# EAGLE design JPC_XE1AP_rev_A (EAGLE 9.6.2)
PC Engine Joypad Breakout Version 1.0
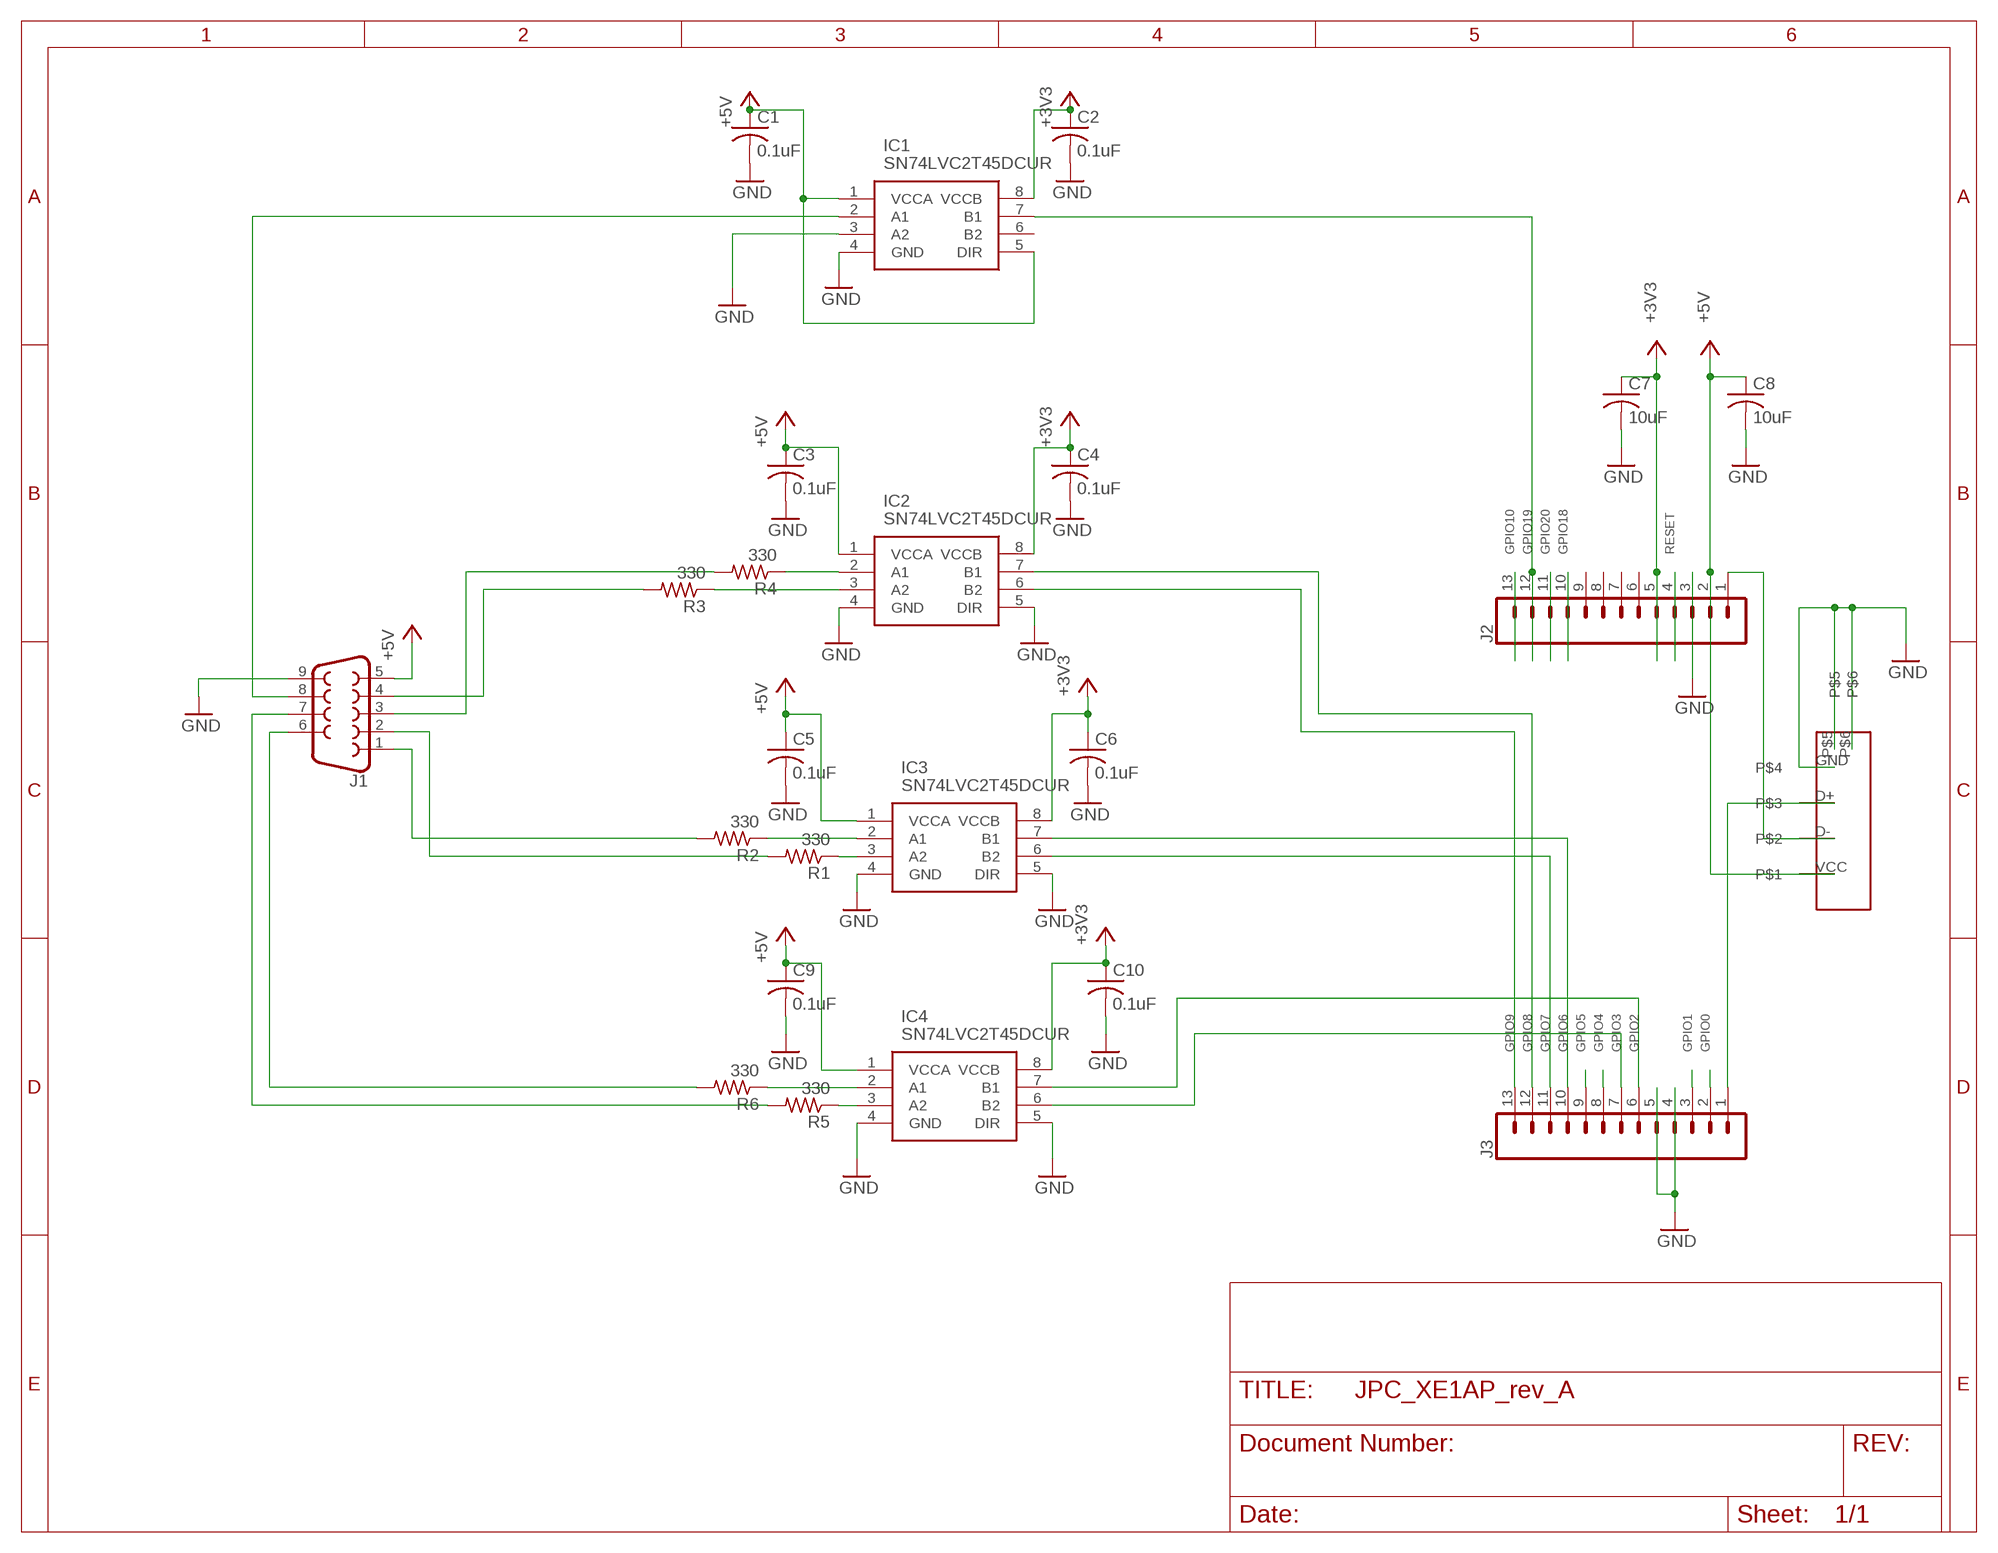
[diagram p0: schematic, sheet 1]

## Parts
C1  0.1uF  C-USC0402  [C0402]
C2  0.1uF  C-USC0402  [C0402]
C3  0.1uF  C-USC0402  [C0402]
C4  0.1uF  C-USC0402  [C0402]
C5  0.1uF  C-USC0402  [C0402]
C6  0.1uF  C-USC0402  [C0402]
C7  10uF  C-USC0805  [C0805]
C8  10uF  C-USC0805  [C0805]
C9  0.1uF  C-USC0402  [C0402]
C10  0.1uF  C-USC0402  [C0402]
IC1  SN74LVC2T45DCUR  [SOP50P310X90-8N]
IC2  SN74LVC2T45DCUR  [SOP50P310X90-8N]
IC3  SN74LVC2T45DCUR  [SOP50P310X90-8N]
IC4  SN74LVC2T45DCUR  [SOP50P310X90-8N]
J1  DB9FEMALE  [DB9]
J2  CONN_131X13-LONGPADS-B  [1X13-LONGPADS-B]
J3  CONN_13LONGPADS  [1X13-LONGPADS]
R1  330  R-US_R0402  [R0402]
R2  330  R-US_R0402  [R0402]
R3  330  R-US_R0402  [R0402]
R4  330  R-US_R0402  [R0402]
R5  330  R-US_R0402  [R0402]
R6  330  R-US_R0402  [R0402]
U$1  912-121A2026S10100  [912-121A2026S10100]

## Nets
+3V3 [power]: C2.1 C4.1 C6.1 C7.1 C10.1 IC1.8(VCCB) IC2.8(VCCB) IC3.8(VCCB) IC4.8(VCCB) J2.5
+5V [power]: C1.1 C3.1 C5.1 C8.1 C9.1 IC1.1(VCCA) IC1.5(DIR) IC2.1(VCCA) IC3.1(VCCA) IC4.1(VCCA) J1.5 J2.2 U$1.VCC
CLR [signal]: IC1.2(A1) J1.8
GND: C1.2 C2.2 C3.2 C4.2 C5.2 C6.2 C7.2 C8.2 C9.2 C10.2 IC1.3(A2) IC1.4(GND) IC2.4(GND) IC2.5(DIR) IC3.4(GND) IC3.5(DIR) IC4.4(GND) IC4.5(DIR) J1.9 J2.3 J3.4 J3.5 U$1.GND U$1.P$5 U$1.P$6
GPIO0: J3.2
GPIO1: J3.3
GPIO2: IC4.7(B1) J3.6
GPIO3: IC4.6(B2) J3.7
GPIO4: J3.8
GPIO5: J3.9
GPIO6: IC3.7(B1) J3.10
GPIO7: IC3.6(B2) J3.11
GPIO8: IC2.7(B1) J3.12
GPIO9: IC2.6(B2) J3.13
GPIO10: J2.13
GPIO18: J2.10
GPIO19: IC1.7(B1) J2.12
GPIO20: J2.11
N$1: J3.1 U$1.D+
N$2: J1.1 R2.2
N$3: IC4.2(A1) R6.1
N$4: IC4.3(A2) R5.1
N$5: J1.2 R1.2
N$6: J1.3 R4.2
N$7: J1.4 R3.2
N$8: IC3.3(A2) R1.1
N$9: IC3.2(A1) R2.1
N$10: IC2.3(A2) R3.1
N$11: IC2.2(A1) R4.1
N$12: J2.1 U$1.D-
N$13: J1.6 R6.2
N$14: J1.7 R5.2
RESET: J2.4
Unconnected: IC1.6(B2) J2.6 J2.7 J2.8 J2.9

## Library data of the parts
C1-C6 C9 C10 = PC-Engine0402:C-US: CAPACITOR, American symbol
C7 C8 = resistor:C-US: CAPACITOR, American symbol
IC1-IC4 = PC-Engine:SN74LVC2T45DCUR: Texas Instruments SN74LVC2T45DCUR, Voltage Level Translator, Bus Transceiver, 3-State, 1.65 5.5 V, 8-Pin UM Source: Datasheet <http://www.ti.com/lit/gpn/sn74lvc2t45>; ARROW_PART_NUMBER: SN74LVC2T45DCUR; ARROW_PRICE-STOCK: https://www.arrow.com/en/products/sn74lvc2t45dcur/texas-instruments?region=nac; DESCRIPTION: Texas Instruments SN74LVC2T45DCUR, Voltage Level Translator, Bus Transceiver, 3-State, 1.65 5.5 V, 8-Pin UM; HEIGHT: 0.9mm; MANUFACTURER_NAME: Texas Instruments; MANUFACTURER_PART_NUMBER: SN74LVC2T45DCUR; MOUSER_PART_NUMBER: 595-SN74LVC2T45DCUR; MOUSER_PRICE-STOCK: https://www.mouser.co.uk/ProductDetail/Texas-Instruments/SN74LVC2T45DCUR?qs=0smPjiIwnfIdG9vxyJHBdA%3D%3D
J1 = SparkFun-Connectors:DB9: DB9 Connector Standard DB9 (D-Sub 9) serial connector. Can be used for CAN bus as well as RS485 and RS232. Footprint production proven. Here is the female version connector we sell at SparkFun: 9 Pin Female Serial Connector - PCB Mount <https://www.sparkfun.com/products/429> (PRT-00429) This connector has been used on the following SparkFun products: SparkFun RS232 Shifter - SMD <https://www.sparkfun.com/products/449> (PRT-00449) SparkFun RS232 Shifter SMD (No DB9) <https://www.sparkfun.com/products/8780> (PRT-08780); PROD_ID: CONN-08194
J2 J3 = KB2040:CONN_13: Multi connection point. Often used as Generic Header-pin footprint for 0.1 inch spaced/style header connections On any of the 0.1 inch spaced packages, you can populate with these: Break Away Headers - Straight <https://www.sparkfun.com/products/116> (PRT-00116) Break Away Male Headers - Right Angle <https://www.sparkfun.com/products/553> (PRT-00553) Female Headers <https://www.sparkfun.com/products/115> (PRT-00115) Break Away Headers - Machine Pin <https://www.sparkfun.com/products/117> (PRT-00117) Break Away Female Headers - Swiss Machine Pin <https://www.sparkfun.com/products/743> (PRT-00743) For SCREWTERMINALS and SPRING TERMINALS visit here: Screw Terimnals on SparkFun.com <https://www.sparkfun.com/search/results?term=Screw+Terminals> (5mm/3.5mm/2.54mm spacing) This device is also useful as a general connection point to wire up your design to another part of your project. Our various solder wires solder well into these plated through hole pads. Hook-Up Wire - Assortment (Stranded, 22 AWG) <https://www.sparkfun.com/products/11375> (PRT-11375) Hook-Up Wire - Assortment (Solid Core, 22 AWG) <https://www.sparkfun.com/products/11367> (PRT-11367) View the entire wire category on our website here <https://www.sparkfun.com/categories/141> Special notes: Molex polarized connector foot print use with SKU : PRT-08231 with associated crimp pins and housings. 1MM SMD Version SKU: PRT-10208 NOTES ON THE VARIANTS LOCK and LOCK_LONGPADS... This footprint was designed to help hold the alignment of a through-hole component (i.e. 6-pin header) while soldering it into place. You may notice that each hole has been shifted either up or down by 0.005 of an inch from it's more standard position (which is a perfectly straight line). This slight alteration caused the pins (the squares in the middle) to touch the edges of the holes. Because they are alternating, it causes a "brace" to hold the component in place. 0.005 has proven to be the perfect amount of "off-center" position when using our standard breakaway headers. Although looks a little odd when you look at the bare footprint, once you have a header in there, the alteration is very hard to notice. Also,if you push a header all the way into place, it is covered up entirely on the bottom side.
R1-R6 = PC-Engine0402:R-US_: RESISTOR, American symbol
U$1 = PC-Engine:912-121A2026S10100

## Net classes
0 default: width 0.152 mm, drill 0.356 mm, clearance 0.152 mm
1 power: width 0.305 mm, drill 0.356 mm, clearance 0.152 mm
2 signal: width 0.152 mm, drill 0.356 mm, clearance 0.152 mm

## Board
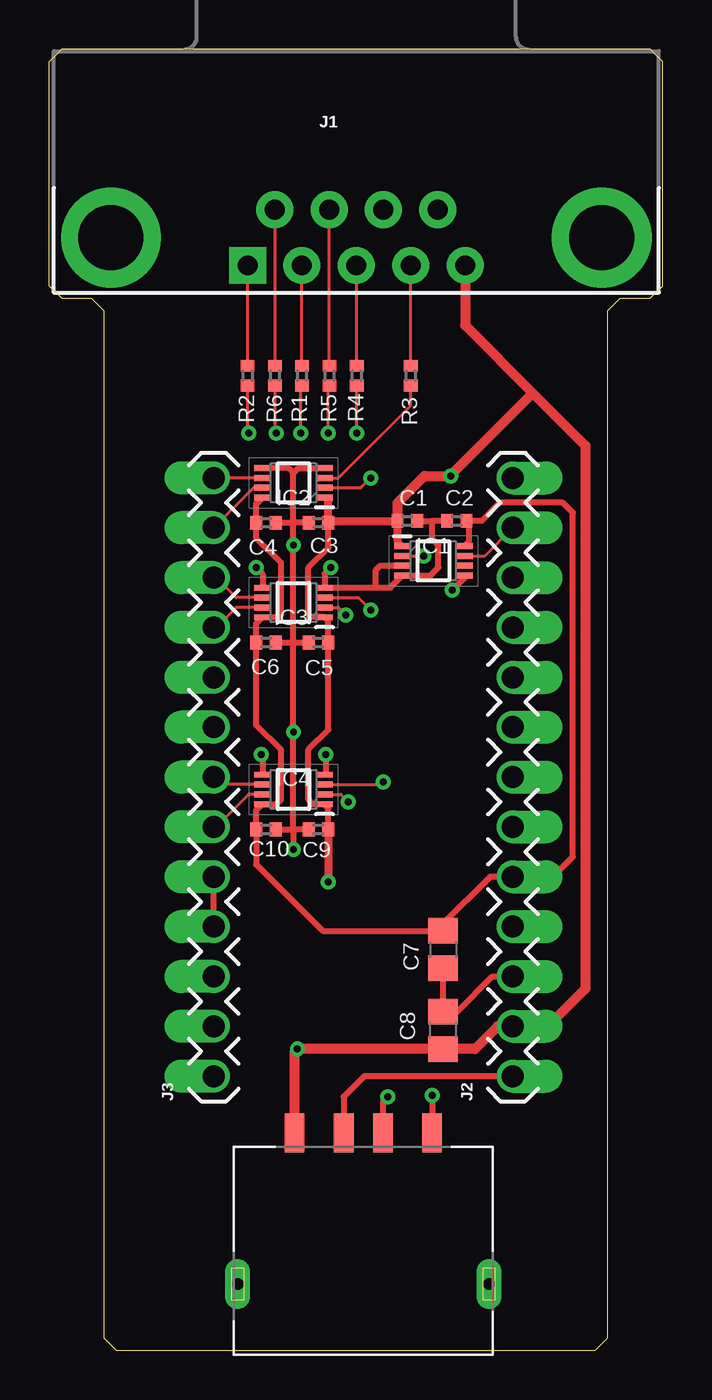
[diagram p1: board, top side]
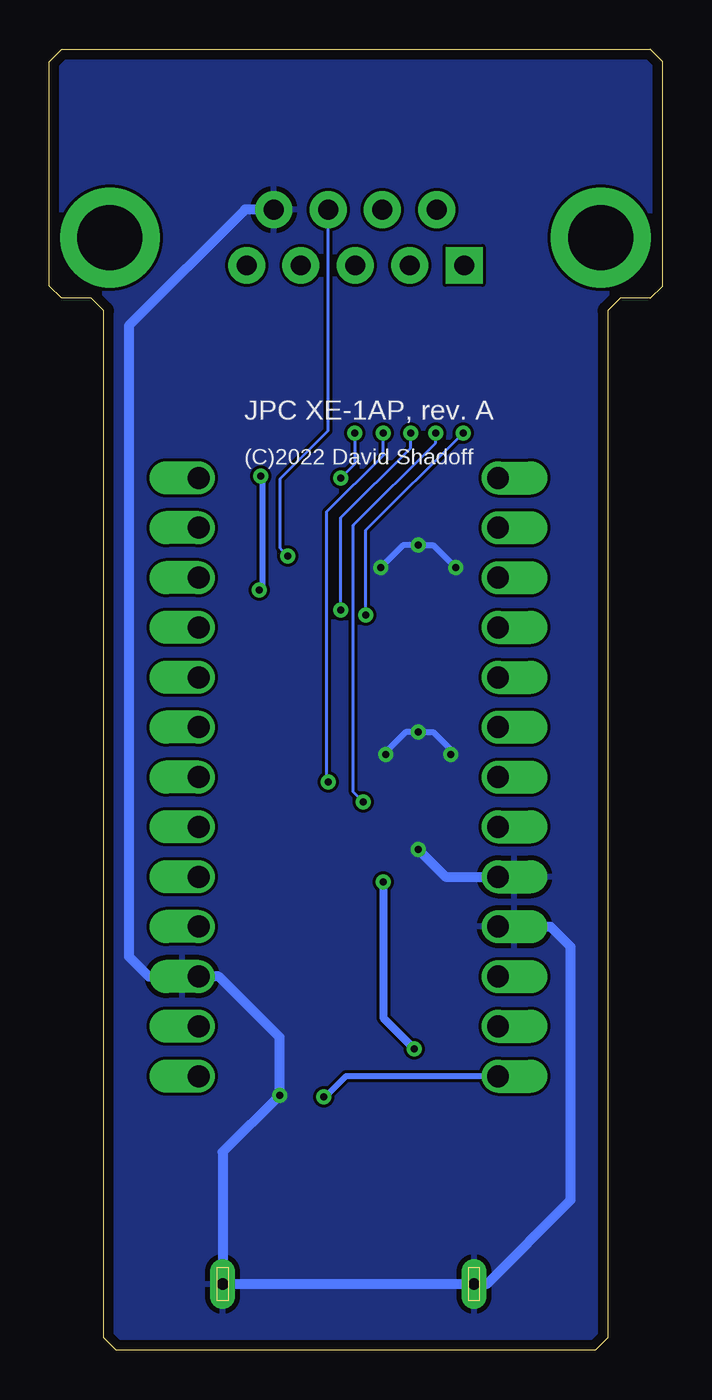
[diagram p2: board, bottom side, seen from below]

Size 31.24 x 66.29 mm. Coordinates in mm from the lower left corner, seen from the top.
Outline: 2.79,52.96 2.79,0.64 3.43,0 27.81,0 28.45,0.64 28.45,52.96 29.08,53.59 30.61,53.59 31.24,54.23 31.24,65.66 30.61,66.29 0.64,66.29 0,65.66 0,54.23 0.64,53.59 2.16,53.59 2.79,52.96
Copper layers (1*16): Top 0.035mm / dielectric 1.5mm / Bottom 0.035mm
Design rules "default *": minimum track width 6mil, minimum drill 0.35mm, track to track 6mil, track to pad 6mil, pad to pad 6mil, via to via 6mil, smd to smd 6mil, copper to edge 20mil, drill to drill 6mil, minimum pad ring 10mil, minimum via ring 8mil, stop-mask expansion 3mil, vias tented up to drill 18mil, thermal gap 10mil

### Footprints (pad centres in the part's own frame; a part is rotated, then mirrored left to right if it is on the bottom)
C0402 = smd 0.6 x 0.7: 1 -0.5,0; 2 0.5,0
C0805 = smd 1.3 x 1.5: 1 -0.95,0; 2 0.95,0
SOP50P310X90-8N = smd 0.85 x 0.3: 1 -1.575,0.75; 2 -1.575,0.25; 3 -1.575,-0.25; 4 -1.575,-0.75; 5 1.575,-0.75; 6 1.575,-0.25; 7 1.575,0.25; 8 1.575,0.75
DB9 = drill 1.016 pad 1.88 square: 1 -5.54,-1.42 | drill 1.016 pad 1.88: 2 -2.77,-1.42; 3 0,-1.42; 4 2.77,-1.42; 5 5.54,-1.42; 6 -4.15,1.42; 7 -1.38,1.42; 8 1.38,1.42; 9 4.15,1.42 | drill 3.302 pad 5.08: G1 -12.5,0; G2 12.5,0
1X13-LONGPADS-B = drill 1.118 offset: 1 0,0; 2 2.54,0; 3 5.08,0; 4 7.62,0; 5 10.16,0; 6 12.7,0; 7 15.24,0; 8 17.78,0; 9 20.32,0; 10 22.86,0; 11 25.4,0; 12 27.94,0; 13 30.48,0
1X13-LONGPADS = drill 1.118 offset: 1 0,0; 2 2.54,0; 3 5.08,0; 4 7.62,0; 5 10.16,0; 6 12.7,0; 7 15.24,0; 8 17.78,0; 9 20.32,0; 10 22.86,0; 11 25.4,0; 12 27.94,0; 13 30.48,0
R0402 = smd 0.6 x 0.7: 1 -0.5,0; 2 0.5,0
912-121A2026S10100 = smd 1 x 2: D+ 1,6; D- -1,6; GND 3.5,6; VCC -3.5,6 | drill 0.6 pad 1.27 long: P$5 -6.4,-1.7; P$6 6.4,-1.7

### Placement (x,y rotation side)
C1  18.25,42.26 0 top
C2  20.76,42.26 180 top
C3  13.72,42.16 180 top
C4  11.05,42.16 0 top
C5  13.72,36.07 180 top
C6  11.05,36.07 0 top
C7  20.07,20.42 270 top
C8  20.07,16.31 90 top
C9  13.72,26.54 180 top
C10  11.05,26.54 0 top
IC1  19.57,40.22 0 top
IC2  12.45,44.2 180 top
IC3  12.45,38.1 180 top
IC4  12.45,28.57 180 top
J1  15.65,56.69 0 top
J2  23.62,13.97 90 top
J3  8.38,13.97 90 top
R1  12.88,49.66 90 top
R2  10.11,49.66 90 top
R3  18.41,49.66 90 top
R4  15.67,49.66 90 top
R5  14.27,49.66 90 top
R6  11.51,49.66 90 top
U$1  16,5.08 0 top

### Tracks (layer width: path | path; a pad name or v marks a point on that pad's centre or on a via)
+3V3
  Top 0.305: IC1.8 21.37,41.2 21.37,42.15 C2.1 22.02,42.26 22.95,43.18 26.16,43.18 26.67,42.67 26.67,25.15 25.65,24.13 J2.5 22.45,24.13 20.07,21.74 C7.1 13.93,21.37 10.55,24.76 C10.1 10.55,27.5 IC4.8 11.57,27.82 11.81,28.07 11.81,30.61 10.55,31.87 C6.1 10.55,37.03 IC3.8 11.7,37.35 11.81,37.47 11.81,40.13 10.55,41.39 C4.1 10.55,43.12 IC2.8
+5V  (via drill 0.36)
  Top 0.305: IC1.5 21.14,39.34 v20.53,38.73 | IC1.1 17.75,41.22 | 12.66,15.36 v12.65,15.37 | 14.31,42.26 C3.1 14.22,40.89 13.21,39.88 13.21,37.47 13.32,37.35 IC3.1 14.22,37.16 C5.1 14.22,31.61 13.21,30.61 13.21,28.07 13.45,27.82 IC4.1 14.22,27.63 C9.1 | 14.22,43.25 IC2.1
  Top 0.406: 17.75,41.22 C1.1 14.31,42.26 | C3.1 14.22,43.25 | C9.1 v14.22,23.88
  Top 0.508: C1.1 17.75,43.18 19.11,44.54 v20.46,44.54 20.46,44.59 24.64,48.77 | J1.5 21.19,52.22 24.64,48.77 | 24.64,48.77 27.3,46.1 27.3,18.41 25.4,16.51 J2.2 22.84,16.51 21.69,15.36 C8.1 12.66,15.36 12.5,15.2 U$1.VCC
  Bottom 0.305: v20.53,38.73 20.38,38.88 20.38,44.47 v20.46,44.54
  Bottom 0.406: v14.22,23.88 14.22,16.94 v12.65,15.37
CLR  (via drill 0.36)
  Top 0.152: IC1.2 v19.08,40.48
  Bottom 0.152: v19.08,40.48 19.46,40.85 19.46,44.42 17.03,46.85 J1.8
GND  (via drill 0.36)
  Top 0.305: C1.2 19.49,42.26 | C2.2 19.49,42.26 | C7.2 C8.2 20.78,17.26 22.57,19.05 J2.3 | J3.4 J3.5 | v19.51,13.01 v19.5,13 U$1.GND | 19.49,42.26 19.49,41.37 19.82,41.04 19.82,39.89 19.41,39.46 18.03,39.46 IC1.4 17.38,38.86 16.64,38.86 | C4.2 12.45,42.16 | C3.2 12.45,42.16 | C6.2 12.45,36.07 | 12.45,36.07 C5.2 | C10.2 12.45,26.54 | C9.2 12.45,26.54 | 12.45,36.07 v12.45,41.02 12.45,42.16 | 12.45,36.07 v12.45,31.5 12.45,26.54 | IC3.4 14.03,38.86 | 14.03,38.86 16.64,38.86 | 16.64,38.86 16.64,39.75 16.86,39.97 IC1.3 | 12.45,26.54 v12.45,25.53 | v14.1,30.35 14.1,29.4 IC4.4 | v10.79,30.35 10.87,30.28 IC4.5 | v10.54,39.88 10.87,39.55 IC3.5 | v14.35,39.88 14.03,39.56 14.03,38.86 | 12.45,42.16 12.45,44.7 | 12.45,44.7 12.2,44.95 IC2.5 | 12.45,44.7 12.69,44.95 IC2.4
  Bottom 0.305: v14.1,30.35 14.1,30.48 13.08,31.5 v12.45,31.5 11.68,31.5 10.79,30.61 v10.79,30.35 | v10.54,39.88 11.68,41.02 v12.45,41.02 13.21,41.02 v14.35,39.88
  Bottom 0.508: J3.4 5.71,21.59 4.7,20.57 4.7,7.65 8.97,3.38 U$1.P$5 U$1.P$6 22.4,10.11 v19.51,13.01 19.51,15.95 22.61,19.05 J2.3 26.16,19.05 27.18,20.07 27.18,52.2 21.26,58.11 J1.9 | v12.45,25.53 11.05,24.13 J3.5
  pour Bottom: -0.25,-0.51 -0.25,66.55 31.62,66.55 31.62,-0.51
GPIO2
  Top 0.152: IC4.7 10.16,28.32 8.51,26.67 J3.6
GPIO3
  Top 0.152: IC4.6 8.77,28.82 J3.7
GPIO6
  Top 0.152: IC3.7 9.53,37.85 8.51,36.83 J3.10
GPIO7
  Top 0.152: IC3.6 9.53,38.35 8.51,39.37 J3.11
GPIO8
  Top 0.152: IC2.7 10.42,43.95 J3.12
GPIO9
  Top 0.152: IC2.6 J3.13
GPIO19
  Top 0.152: IC1.7 22.19,40.47 J2.12
N$1  (via drill 0.36)
  Top 0.305: v17.24,12.93 17,12.68 U$1.D+
  Bottom 0.305: J3.1 16.13,13.97 17.17,12.93 v17.24,12.93
N$2
  Top 0.152: R2.2 J1.1
N$3  (via drill 0.36)
  Top 0.152: IC4.2 14.86,28.32 v15.24,27.94 | v11.56,46.74 11.51,46.79 R6.1
  Bottom 0.152: v15.24,27.94 15.75,28.45 15.75,42.04 11.56,46.23 v11.56,46.74
N$4  (via drill 0.36)
  Top 0.152: IC4.3 16.76,28.82 16.89,28.96 v17.02,28.96 | v14.22,46.74 14.22,49.11 R5.1
  Bottom 0.152: v17.02,28.96 17.12,29.06 17.12,42.7 14.22,45.59 v14.22,46.74
N$5
  Top 0.152: R1.2 J1.2
N$6
  Top 0.152: R4.2 15.67,55.25 J1.3
N$7
  Top 0.152: R3.2 J1.4
N$8  (via drill 0.36)
  Top 0.152: IC3.3 15.75,38.35 v16.38,37.72 | v12.83,46.74 12.83,49.11 R1.1
  Bottom 0.152: v16.38,37.72 16.38,42.42 12.83,45.97 v12.83,46.74
N$9  (via drill 0.36)
  Top 0.152: IC3.2 14.73,37.85 v15.11,37.47 | v10.16,46.74 10.11,46.79 R2.1
  Bottom 0.152: v10.16,46.74 15.11,41.78 v15.11,37.47
N$10
  Top 0.152: IC2.3 14.73,44.45 18.41,48.13 R3.1
N$11  (via drill 0.36)
  Top 0.152: IC2.2 15.88,43.95 v16.38,44.45 | v15.67,46.74 R4.1
  Bottom 0.152: v16.38,44.45 15.67,45.16 v15.67,46.74
N$12
  Top 0.305: U$1.D- 15,12.92 16.05,13.97 J2.1
N$13
  Top 0.152: R6.2 J1.6
N$14
  Top 0.152: R5.2 J1.7

### Text on the board
bNames: JPC XE-1AP, rev. A | (C)2022 David Shadoff
tValues: JLCJLCJLCJLC